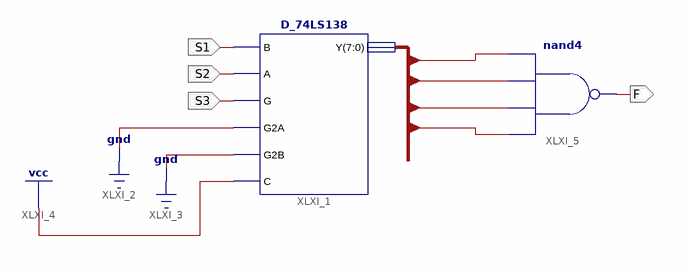
[diagram p0: schematic sheet 1]
// Xilinx ISE schematic LampCtrl.sch (kintex7) as structural Verilog: 2 symbols, 4 ports
module LampCtrl (
  input  S1,
  input  S2,
  input  S3,
  output F
);

  wire [7:0] XLXN_16;

  D_74LS138 XLXI_1 (.B(S1), .A(S2), .G(S3), .G2A(1'b0), .G2B(1'b0), .C(1'b1), .Y(XLXN_16));
  nand XLXI_5 (F, XLXN_16[4], XLXN_16[2], XLXN_16[1], XLXN_16[7]);
endmodule
